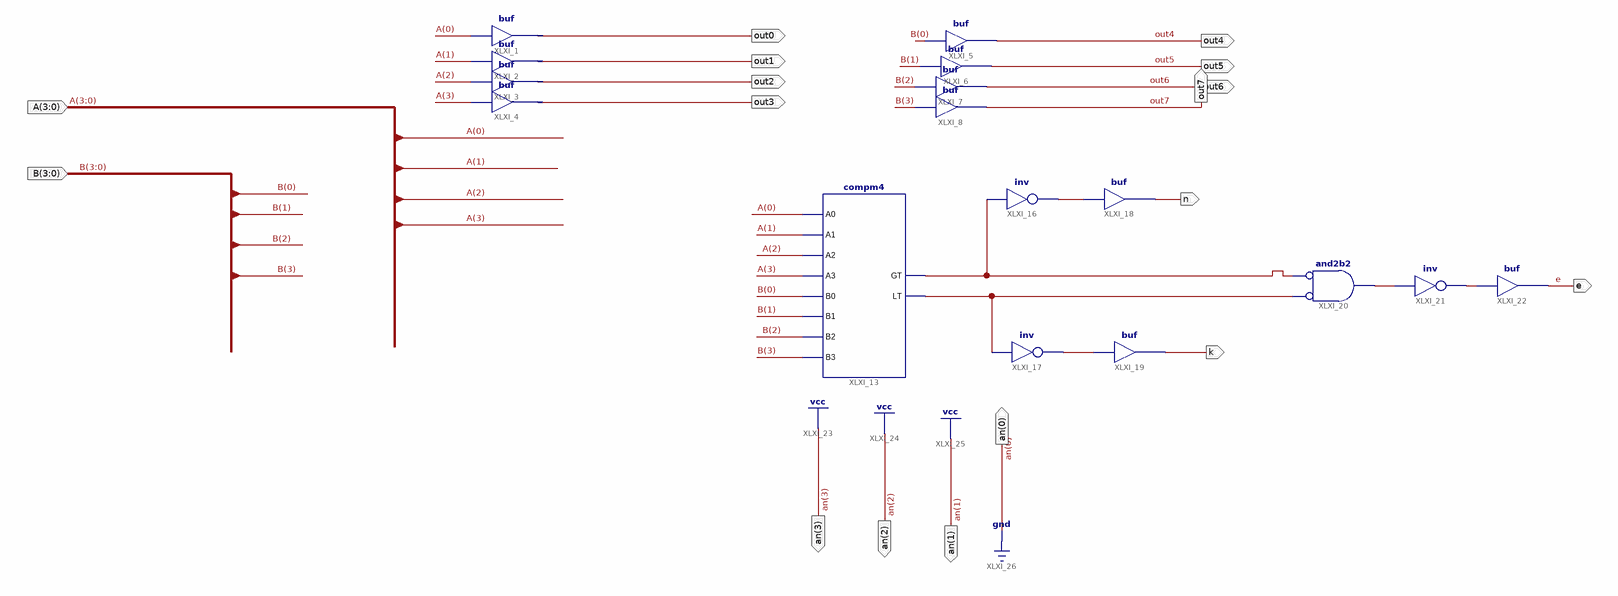
[diagram p0: schematic sheet 1]
// Xilinx ISE schematic komparator.sch (spartan3e) as structural Verilog: 16 symbols, 17 ports
module komparator (
  input  [3:0] A,
  input  [3:0] B,
  output out0,
  output out1,
  output out2,
  output out3,
  output out4,
  output out6,
  output out7,
  output out5,
  output n,
  output k,
  output e,
  output [3:0] an
);

  wire XLXN_45, XLXN_46, XLXN_50, XLXN_51;

  buf XLXI_1 (out0, A[0]);
  buf XLXI_2 (out1, A[1]);
  buf XLXI_3 (out2, A[2]);
  buf XLXI_4 (out3, A[3]);
  buf XLXI_5 (out4, B[0]);
  buf XLXI_7 (out6, B[2]);
  buf XLXI_8 (out7, B[3]);
  buf XLXI_6 (out5, B[1]);
  compm4 XLXI_13 (
    .A0(A[0]), .A1(A[1]), .A2(A[2]), .A3(A[3]), .B0(B[0]), .B1(B[1]), .B2(B[2]), .B3(B[3]), .GT(n), .LT(k));
  not XLXI_16 (XLXN_45, n);
  not XLXI_17 (XLXN_46, k);
  buf XLXI_18 (n, XLXN_45);
  buf XLXI_19 (k, XLXN_46);
  and XLXI_20 (XLXN_50, ~k, ~n);  // and2b2
  not XLXI_21 (XLXN_51, XLXN_50);
  buf XLXI_22 (e, XLXN_51);

  assign an = 4'b1110;
endmodule
